# EAGLE design athf-er (EAGLE 6.3)
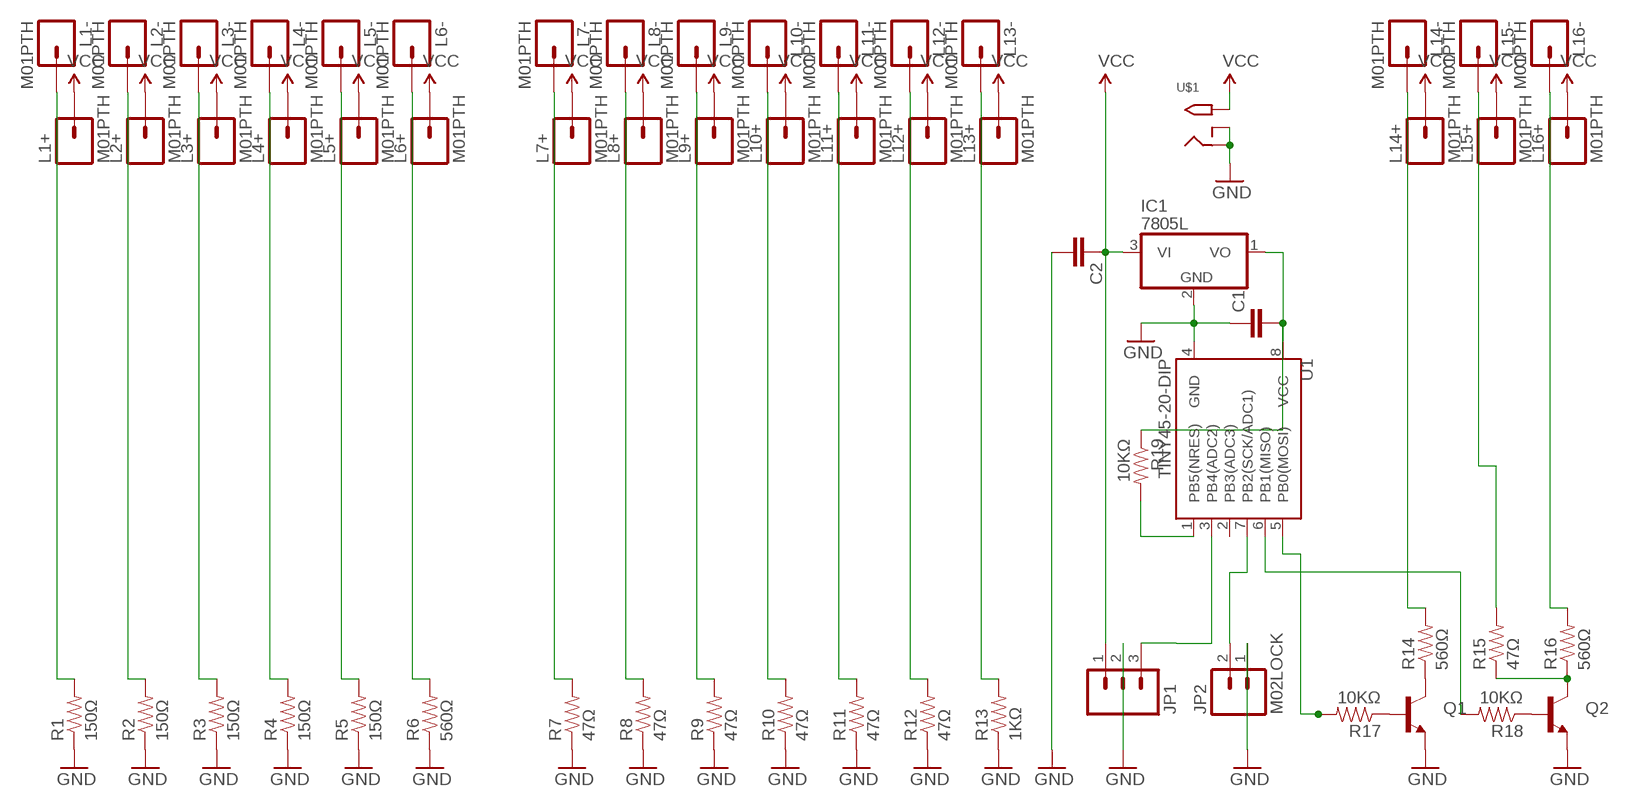
[diagram p0: schematic, sheet 1]

## Parts
C1  CAPEZ  [CAP-PTH-SMALLEZ]
C2  CAPEZ  [CAP-PTH-SMALLEZ]
IC1  7805L  [TO92]
JP1  M03LOCK  [1X03_LOCK]
JP2  M02LOCK  [1X02_LOCK]
L1+  M01PTH  [1X01]
L1-  M01PTH  [1X01]
L2+  M01PTH  [1X01]
L2-  M01PTH  [1X01]
L3+  M01PTH  [1X01]
L3-  M01PTH  [1X01]
L4+  M01PTH  [1X01]
L4-  M01PTH  [1X01]
L5+  M01PTH  [1X01]
L5-  M01PTH  [1X01]
L6+  M01PTH  [1X01]
L6-  M01PTH  [1X01]
L7+  M01PTH  [1X01]
L7-  M01PTH  [1X01]
L8+  M01PTH  [1X01]
L8-  M01PTH  [1X01]
L9+  M01PTH  [1X01]
L9-  M01PTH  [1X01]
L10+  M01PTH  [1X01]
L10-  M01PTH  [1X01]
L11+  M01PTH  [1X01]
L11-  M01PTH  [1X01]
L12+  M01PTH  [1X01]
L12-  M01PTH  [1X01]
L13+  M01PTH  [1X01]
L13-  M01PTH  [1X01]
L14+  M01PTH  [1X01]
L14-  M01PTH  [1X01]
L15+  M01PTH  [1X01]
L15-  M01PTH  [1X01]
L16+  M01PTH  [1X01]
L16-  M01PTH  [1X01]
Q1  TRANSISTOR_NPNTO92  [TO-92]
Q2  TRANSISTOR_NPNTO92  [TO-92]
R1  150Ω  RESISTOREZ  [AXIAL-0.3EZ]
R2  150Ω  RESISTOREZ  [AXIAL-0.3EZ]
R3  150Ω  RESISTOREZ  [AXIAL-0.3EZ]
R4  150Ω  RESISTOREZ  [AXIAL-0.3EZ]
R5  150Ω  RESISTOREZ  [AXIAL-0.3EZ]
R6  560Ω  RESISTOREZ  [AXIAL-0.3EZ]
R7  47Ω  RESISTOREZ  [AXIAL-0.3EZ]
R8  47Ω  RESISTOREZ  [AXIAL-0.3EZ]
R9  47Ω  RESISTOREZ  [AXIAL-0.3EZ]
R10  47Ω  RESISTOREZ  [AXIAL-0.3EZ]
R11  47Ω  RESISTOREZ  [AXIAL-0.3EZ]
R12  47Ω  RESISTOREZ  [AXIAL-0.3EZ]
R13  1KΩ  RESISTOREZ  [AXIAL-0.3EZ]
R14  560Ω  RESISTOREZ  [AXIAL-0.3EZ]
R15  47Ω  RESISTOREZ  [AXIAL-0.3EZ]
R16  560Ω  RESISTOREZ  [AXIAL-0.3EZ]
R17  10KΩ  RESISTOREZ  [AXIAL-0.3EZ]
R18  10KΩ  RESISTOREZ  [AXIAL-0.3EZ]
R19  10KΩ  RESISTOREZ  [AXIAL-0.3EZ]
U1  TINY45-20-DIP  ATTINY45TINY45-20-DIP  [DIP08]
U$1  2.1MMJACKTHM  [PJ-102A]

## Nets
GND: C1.1 C2.2 IC1.2(GND) JP1.2 JP2.1 Q1.1(E) Q2.1(E) R1.P$1 R2.P$1 R3.P$1 R4.P$1 R5.P$1 R6.P$1 R7.P$1 R8.P$1 R9.P$1 R10.P$1 R11.P$1 R12.P$1 R13.P$1 U1.4(GND) U$1.RING U$1.RING_SW
N$1: L1-.1 R1.P$2
N$2: L2-.1 R2.P$2
N$3: L3-.1 R3.P$2
N$4: L4-.1 R4.P$2
N$5: L5-.1 R5.P$2
N$6: L6-.1 R6.P$2
N$7: L7-.1 R7.P$2
N$8: L8-.1 R8.P$2
N$9: L9-.1 R9.P$2
N$10: L10-.1 R10.P$2
N$11: L11-.1 R11.P$2
N$12: L12-.1 R12.P$2
N$13: L13-.1 R13.P$2
N$14: L14-.1 R14.P$2
N$15: L16-.1 R16.P$2
N$118: L15-.1 R15.P$2
N$122: JP2.2 U1.7(PB2(SCK/ADC1))
N$124: Q2.3(C) R15.P$1 R16.P$1
N$125: Q1.2(B) R17.P$1
N$126: Q1.3(C) R14.P$1
N$127: Q2.2(B) R18.P$1
N$128: JP1.3 U1.3(PB4(ADC2))
N$129: C1.2 IC1.1(VO) R19.P$1 U1.8(VCC)
N$131: R18.P$2 U1.6(PB1(MISO))
N$134: R19.P$2 U1.1(PB5(NRES))
N$135: R17.P$2 U1.5(PB0(MOSI))
VCC: C2.1 IC1.3(VI) JP1.1 L1+.1 L2+.1 L3+.1 L4+.1 L5+.1 L6+.1 L7+.1 L8+.1 L9+.1 L10+.1 L11+.1 L12+.1 L13+.1 L14+.1 L15+.1 L16+.1 U$1.TIP
Unconnected: U1.2(PB3(ADC3))

## Library data of the parts
C1 C2 = SparkFun-Passives:CAP: Capacitor Standard 0603 ceramic capacitor, and 0.1" leaded capacitor.
IC1 = adafruit:78*: Positive VOLTAGE REGULATOR Added bigger pads to the TO-92 package
JP1 = SparkFun-Connectors:M03: Header 3 Standard 3-pin 0.1" header. Use with straight break away headers (SKU : PRT-00116), right angle break away headers (PRT-00553), swiss pins (PRT-00743), machine pins (PRT-00117), and female headers (PRT-00115). Molex polarized connector foot print use with SKU : PRT-08232 with associated crimp pins and housings.
JP2 = SparkFun-Connectors:M02: Standard 2-pin 0.1" header. Use with - straight break away headers ( PRT-00116) - right angle break away headers (PRT-00553) - swiss pins (PRT-00743) - machine pins (PRT-00117) - female headers (PRT-00115) Molex polarized connector foot print use with: PRT-08233 with associated crimp pins and housings. 2.54_SCREWTERM for use with PRT-10571. 3.5mm Screw Terminal footprints for PRT-08084 5mm Screw Terminal footprints for use with PRT-08433
L1+ L1- L2+ L2- L3+ L3- L4+ L4- L5+ L5- L6+ L6- L7+ L7- L8+ L8- L9+ L9- L10+ L10- L11+ L11- L12+ L12- L13+ L13- L14+ L14- L15+ L15- L16+ L16- = SparkFun-Connectors:M01: Header 1 Standard 1-pin 0.1" header. Use with straight break away headers (SKU : PRT-00116), right angle break away headers (PRT-00553), swiss pins (PRT-00743), machine pins (PRT-00117), and female headers (PRT-00115).
Q1 Q2 = SparkFun-DiscreteSemi:TRANSISTOR_NPN: Generic NPN BJT MMBT2222A - TRANS-08049 (SOT-23, 1A 40V) MPSA42 - TRANS-09116 (SOT-23, 500mA 300V) MMBT5088LT1G - TRANS-11160 (SOT-23, 50 mA 30V)
R1-R19 = SparkFun-Passives:RESISTOR: Resistor Basic schematic elements and footprints for 0603, 1206, and PTH resistors.
U1 = SparkFun-DigitalIC:ATTINY45: Atmel 8-pin 2/4/8kB flash uC; PROD_ID: IC-09439
U$1 = adafruit:2.1MMJACK: 2.1mm x 5.5mm THM DC jack with internal switch. Digikey part #PJ-102A, 4UCON part #05537 2.1mm x 5.5mm SMT DC jack with internal switch. Digikey part #PJ-002A-SMT, 4UCON part #03267 By microbuilder.eu & adafruit.com

## Board
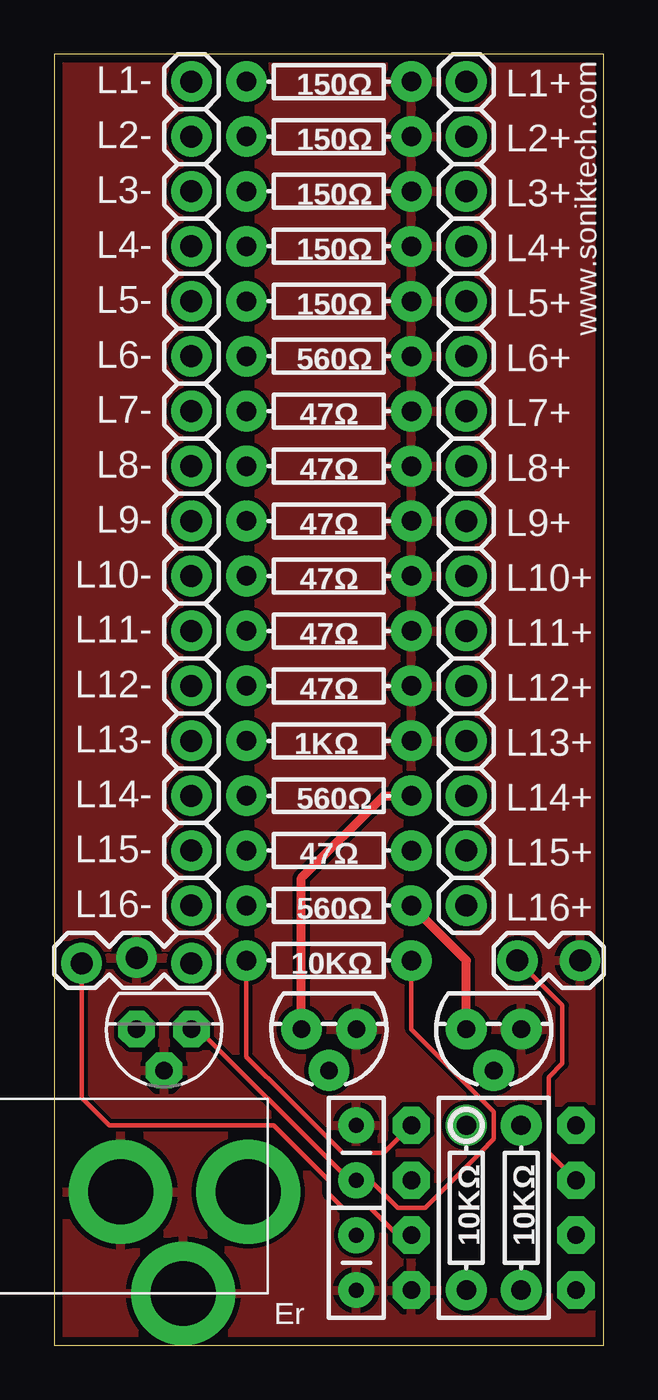
[diagram p1: board, top side]
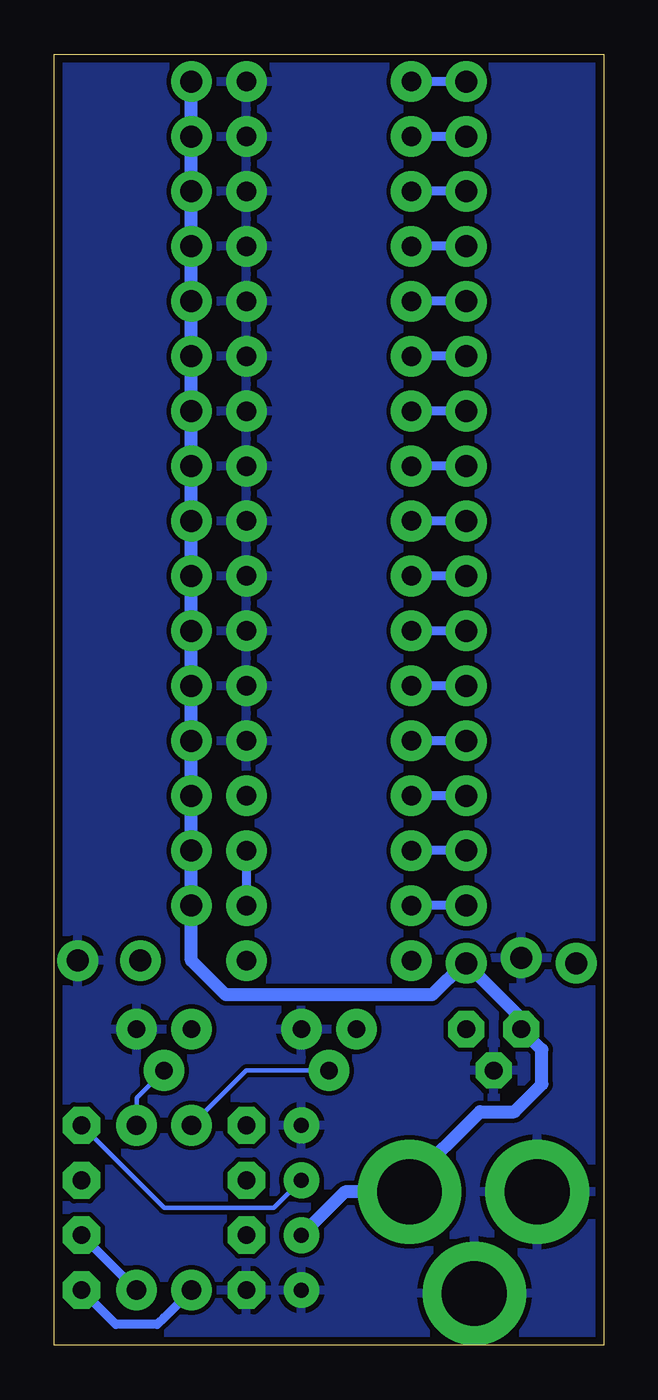
[diagram p2: board, bottom side, seen from below]

Size 25.4 x 59.69 mm. Coordinates in mm from the lower left corner, seen from the top.
Outline: 0,0 25.4,0 25.4,59.69 0,59.69 0,0
Copper layers (1*16): Top 0.0356mm / dielectric 1.5011mm / Bottom 0.0356mm
Design rules "OSHparkPCBorder8mil": minimum track width 8mil, minimum drill 13mil, track to track 8mil, track to pad 8mil, pad to pad 8mil, via to via 8mil, smd to smd 8mil, copper to edge 15mil, drill to drill 6mil, minimum pad ring 7mil, minimum via ring 7mil, stop-mask expansion 3mil, vias tented up to drill 13mil, thermal gap 10mil

### Footprints (pad centres in the part's own frame; a part is rotated, then mirrored left to right if it is on the bottom)
CAP-PTH-SMALLEZ = drill 0.7 pad 1.651: 1 0,0; 2 2.54,0
TO92 = drill 0.813 pad 1.676 octagon: 1 -1.27,0; 2 0,1.905; 3 1.27,0
1X03_LOCK = drill 1.016 pad 1.88: 1 0,0.127; 2 2.54,-0.127; 3 5.08,0.127
1X02_LOCK = drill 1.016 pad 1.88: 1 -0.178,0; 2 2.718,0
1X01 = drill 1.016 pad 1.88: 1 0,0
TO-92 = drill 0.813 pad 1.88: 1 -1.27,0; 2 0,1.905; 3 1.27,0
AXIAL-0.3EZ = drill 0.9 pad 1.88: P$1 -3.81,0; P$2 3.81,0
DIP08 = drill 0.813 pad 1.727 octagon: 1 -3.81,-3.81; 2 -1.27,-3.81; 3 1.27,-3.81; 4 3.81,-3.81; 5 3.81,3.81; 6 1.27,3.81; 7 -1.27,3.81; 8 -3.81,3.81
PJ-102A = drill 3 pad 4.8: RING 0.1,-3.39; RING_SW -4.6,-6.29; TIP 0.1,-9.29

### Placement (x,y rotation side)
C1  13.97,10.16 270 top
C2  13.97,5.08 270 top
IC1  5.08,14.61 180 top
JP1  6.35,17.78 180 top
JP2  24.13,17.78 180 top
L1+  19.05,58.42 0 top
L1-  6.35,58.42 0 top
L2+  19.05,55.88 0 top
L2-  6.35,55.88 0 top
L3+  19.05,53.34 0 top
L3-  6.35,53.34 0 top
L4+  19.05,50.8 0 top
L4-  6.35,50.8 0 top
L5+  19.05,48.26 0 top
L5-  6.35,48.26 0 top
L6+  19.05,45.72 0 top
L6-  6.35,45.72 0 top
L7+  19.05,43.18 0 top
L7-  6.35,43.18 0 top
L8+  19.05,40.64 0 top
L8-  6.35,40.64 0 top
L9+  19.05,38.1 0 top
L9-  6.35,38.1 0 top
L10+  19.05,35.56 0 top
L10-  6.35,35.56 0 top
L11+  19.05,33.02 0 top
L11-  6.35,33.02 0 top
L12+  19.05,30.48 0 top
L12-  6.35,30.48 0 top
L13+  19.05,27.94 0 top
L13-  6.35,27.94 0 top
L14+  19.05,25.4 0 top
L14-  6.35,25.4 0 top
L15+  19.05,22.86 0 top
L15-  6.35,22.86 0 top
L16+  19.05,20.32 0 top
L16-  6.35,20.32 0 top
Q1  12.7,14.61 180 top
Q2  20.32,14.61 180 top
R1  12.7,58.42 180 top
R2  12.7,55.88 180 top
R3  12.7,53.34 180 top
R4  12.7,50.8 180 top
R5  12.7,48.26 180 top
R6  12.7,45.72 180 top
R7  12.7,43.18 180 top
R8  12.7,40.64 180 top
R9  12.7,38.1 180 top
R10  12.7,35.56 180 top
R11  12.7,33.02 180 top
R12  12.7,30.48 180 top
R13  12.7,27.94 180 top
R14  12.7,25.4 180 top
R15  12.7,22.86 180 top
R16  12.7,20.32 180 top
R17  19.05,6.35 270 top
R18  21.59,6.35 270 top
R19  12.7,17.78 180 top
U1  20.32,6.35 270 top
U$1  -0.32,6.99 90 top

### Tracks (layer width: path | path; a pad name or v marks a point on that pad's centre or on a via)
GND
  pour Top: 0,0 25.4,0 25.4,59.69 0,59.69
  pour Bottom: 0,0 25.4,0 25.4,59.69 0,59.69
N$1
  Bottom 0.406: L1-.1 R1.P$2
N$2
  Bottom 0.406: L2-.1 R2.P$2
N$3
  Bottom 0.406: L3-.1 R3.P$2
N$4
  Bottom 0.406: L4-.1 R4.P$2
N$5
  Bottom 0.406: L5-.1 R5.P$2
N$6
  Bottom 0.406: L6-.1 R6.P$2
N$7
  Bottom 0.406: L7-.1 R7.P$2
N$8
  Bottom 0.406: L8-.1 R8.P$2
N$9
  Bottom 0.406: L9-.1 R9.P$2
N$10
  Bottom 0.406: L10-.1 R10.P$2
N$11
  Bottom 0.406: L11-.1 R11.P$2
N$12
  Bottom 0.406: L12-.1 R12.P$2
N$13
  Bottom 0.406: L13-.1 R13.P$2
N$14
  Bottom 0.406: L14-.1 R14.P$2
N$15
  Bottom 0.406: L16-.1 R16.P$2
N$118
  Bottom 0.406: L15-.1 R15.P$2
N$122
  Top 0.203: U1.7 22.86,8.89 22.86,12.38 23.5,13.02 23.5,15.7 JP2.2
N$124
  Top 0.406: Q2.3 19.05,17.78 R16.P$1
  Bottom 0.406: R15.P$1 R16.P$1
N$125
  Bottom 0.203: R17.P$1 16.51,12.7 Q1.2
N$126
  Top 0.406: Q1.3 11.43,20.32 11.43,21.59 15.24,25.4 R14.P$1
N$127
  Bottom 0.203: R18.P$1 21.59,11.43 Q2.2
N$128
  Top 0.203: U1.3 15.88,5.08 14.61,6.35 13.34,6.35 12.7,6.99 12.7,7.62 10.16,10.16 2.54,10.16 1.27,11.43 JP1.3
N$129
  Top 0.203: R19.P$1 16.51,14.61 19.05,12.06 20.32,10.79 20.32,9.53 19.68,8.89 17.14,6.35 15.88,6.35 14.61,7.62 C1.2 13.65,7.62 13.02,8.26 6.67,14.61 IC1.1
  Bottom 0.203: U1.8 20.32,6.35 15.24,6.35 C1.2
N$131
  Bottom 0.406: R18.P$2 U1.6
N$134
  Top 0.203: R19.P$2 8.89,13.34 10.79,11.43 13.34,8.89 15.24,8.89 U1.1
N$135
  Bottom 0.406: R17.P$2 20.32,1.27 20.64,0.95 22.54,0.95 22.86,1.27 U1.5
VCC
  Bottom 0.61: L1+.1 L2+.1 L3+.1 L4+.1 L5+.1 L6+.1 L7+.1 L8+.1 L9+.1 L10+.1 L11+.1 L12+.1 L13+.1 L14+.1 L15+.1 L16+.1 19.05,17.78 17.46,16.19 7.94,16.19 6.48,17.65 JP1.1 3.81,15.11 IC1.3 2.86,13.65 2.86,12.06 4.13,10.79 5.71,10.79 8.97,7.54 U$1.TIP 11.96,7.08 C2.1

### Text on the board
tNames: www.soniktech.com | Er
tValues: SENSE | - | + | 7805 | SPKR | NPN | NPN | 24VDC | .1uF | .1uF | ATTINYx5